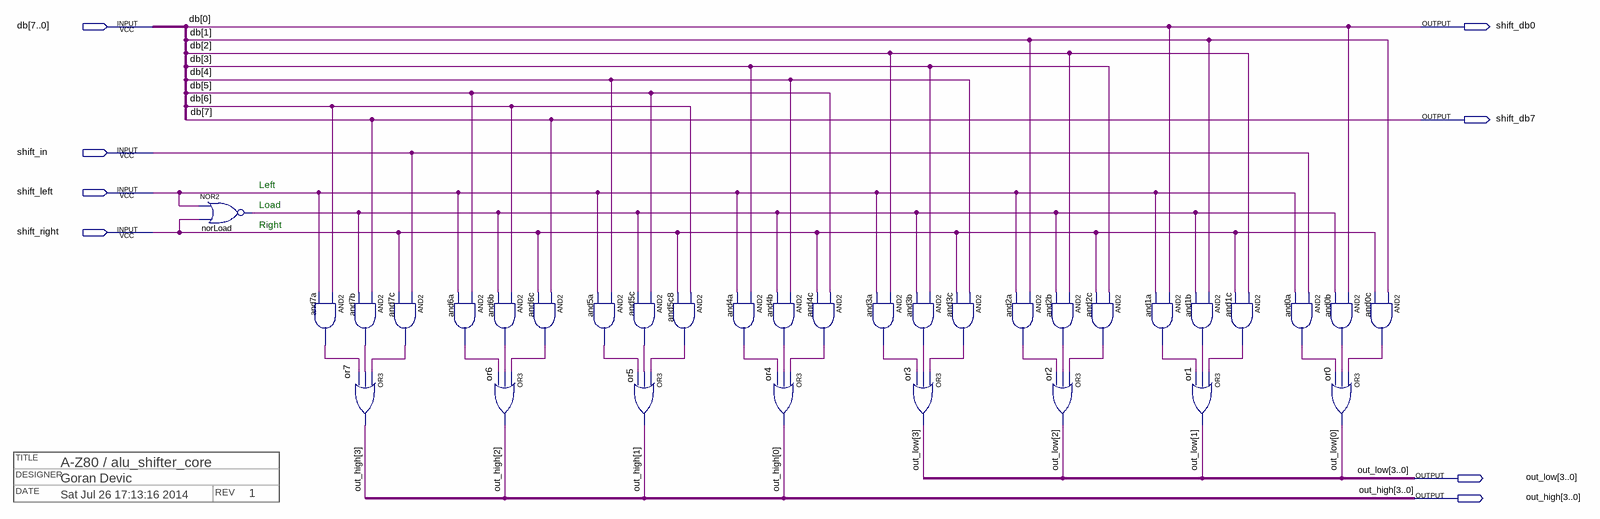
[diagram p0: schematic sheet]
// Quartus schematic alu_shifter_core.bdf as structural Verilog: 33 symbols, 8 pins
// Title block: DATE: Sat Jul 26 17:13:16 2014; DESIGNER: Goran Devic; REV: 1; TITLE: A-Z80 / alu_shifter_core
module alu_shifter_core (
  input  [7:0] db,
  input  shift_in,
  input  shift_left,
  input  shift_right,
  output shift_db0,
  output shift_db7,
  output [3:0] out_low,
  output [3:0] out_high
);

  wire and0a_out, and0b_out, and0c_out, and1a_out, and1b_out, and1c_out, and2a_out, and2b_out, and2c_out,
       and3a_out, and3b_out, and3c_out, and4a_out, and4b_out, and4c_out, and5a_out, and5c8_out, and5c_out,
       and6a_out, and6b_out, and6c_out, and7a_out, and7b_out, and7c_out, norLoad_out;

  nor norLoad (norLoad_out, shift_left, shift_right);
  and and7a (and7a_out, db[6], shift_left);
  and and7b (and7b_out, db[7], norLoad_out);
  or or7 (out_high[3], and7c_out, and7b_out, and7a_out);
  and and7c (and7c_out, shift_in, shift_right);
  and and6a (and6a_out, db[5], shift_left);
  and and6b (and6b_out, db[6], norLoad_out);
  or or6 (out_high[2], and6c_out, and6b_out, and6a_out);
  and and6c (and6c_out, db[7], shift_right);
  and and5c (and5c_out, db[5], norLoad_out);
  and and5a (and5a_out, db[4], shift_left);
  or or5 (out_high[1], and5c8_out, and5c_out, and5a_out);
  and and5c8 (and5c8_out, db[6], shift_right);
  and and4a (and4a_out, db[3], shift_left);
  and and4b (and4b_out, db[4], norLoad_out);
  or or4 (out_high[0], and4c_out, and4b_out, and4a_out);
  and and4c (and4c_out, db[5], shift_right);
  and and3a (and3a_out, db[2], shift_left);
  and and3b (and3b_out, db[3], norLoad_out);
  and and3c (and3c_out, db[4], shift_right);
  or or3 (out_low[3], and3c_out, and3b_out, and3a_out);
  and and2a (and2a_out, db[1], shift_left);
  and and2b (and2b_out, db[2], norLoad_out);
  or or2 (out_low[2], and2c_out, and2b_out, and2a_out);
  and and2c (and2c_out, db[3], shift_right);
  and and1a (and1a_out, db[0], shift_left);
  and and1b (and1b_out, db[1], norLoad_out);
  or or1 (out_low[1], and1c_out, and1b_out, and1a_out);
  and and1c (and1c_out, db[2], shift_right);
  and and0a (and0a_out, shift_in, shift_left);
  and and0b (and0b_out, db[0], norLoad_out);
  and and0c (and0c_out, db[1], shift_right);
  or or0 (out_low[0], and0c_out, and0b_out, and0a_out);

  assign shift_db0 = db[0];
  assign shift_db7 = db[7];

  // Notes on the sheet:
  //   Left
  //   Load
  //   Right
endmodule
